# Altium project MPPT_V1.0.1.PrjPcb
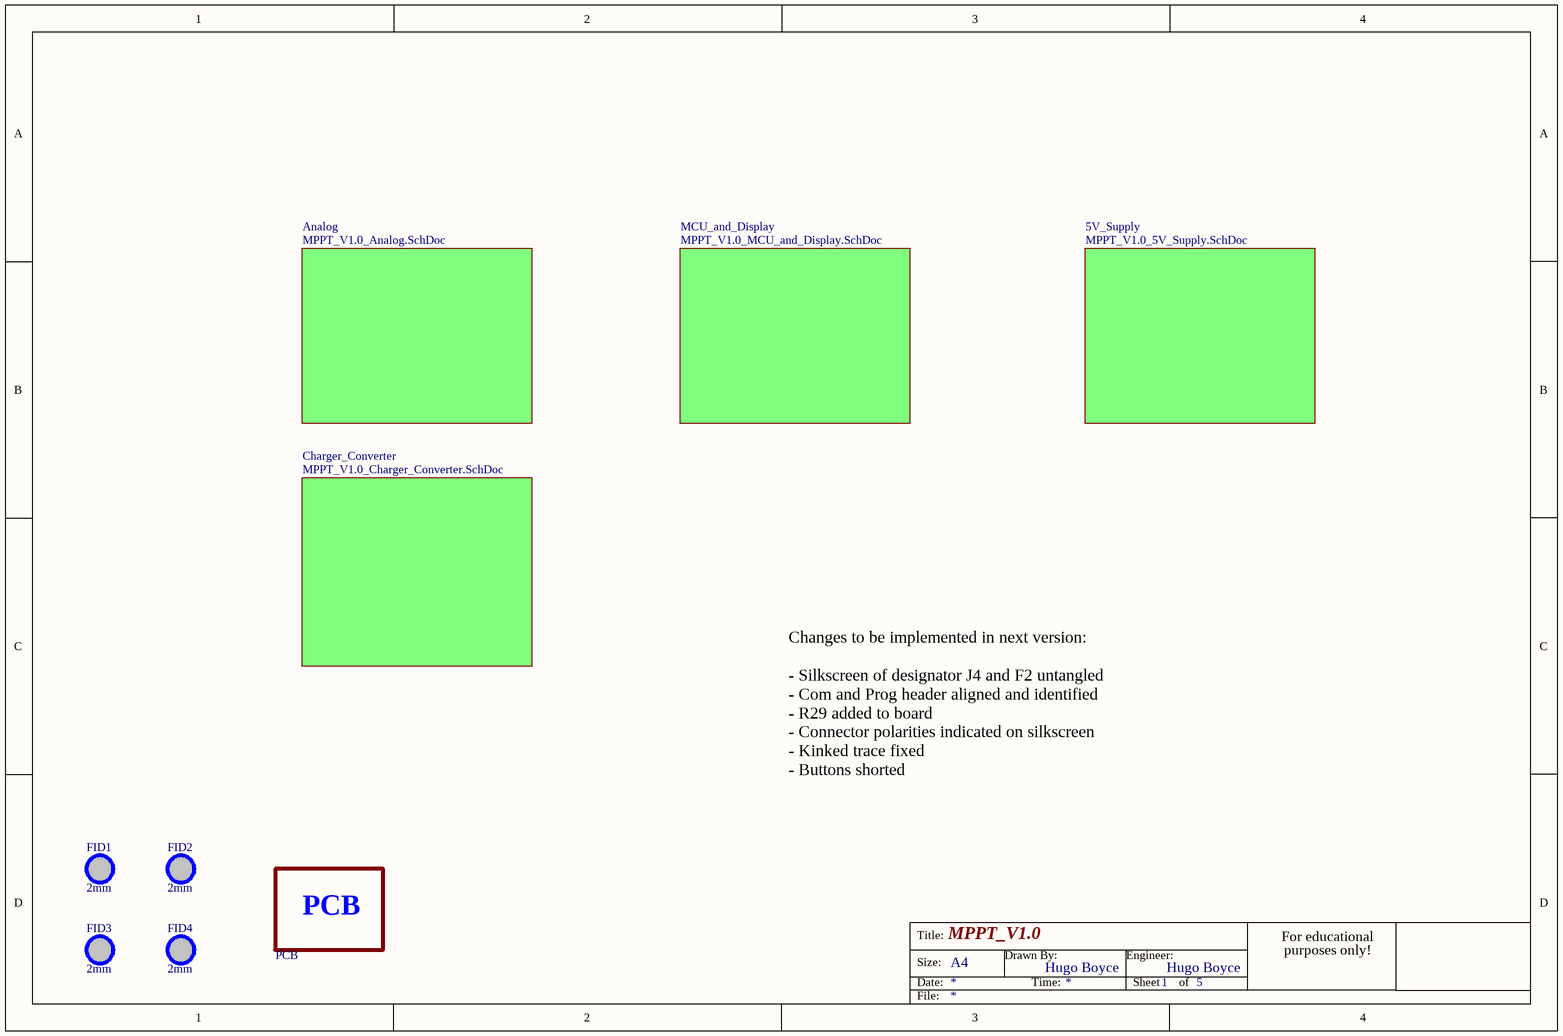
[diagram p0: MPPT_V1.0.1_Main.SchDoc]
Dessinateur: Hugo Boyce; ProjectDrawnBy: Hugo Boyce; Title: MPPT V1.0.1
5 sheets, 92 parts. Net scope: global (net labels, ports and power ports of the same name join across sheets).
Board file: MPPT_V1.0.1.PcbDoc
Sheets:
  MPPT_V1.0.1_Main.SchDoc
  MPPT_V1.0.1_MCU_and_Display.SchDoc
  MPPT_V1.0.1_Analog.SchDoc
  MPPT_V1.0.1_5V_Supply.SchDoc
  MPPT_V1.0.1_Charger_Converter.SchDoc

## Sheet MPPT_V1.0.1_Main.SchDoc: MPPT_V1.0
size A4; DrawnBy: Hugo Boyce; Engineer: Hugo Boyce; Organization: Altium Limited; Address1: L3, 12a Rodborough Rd; Address2: Frenchs Forest; Address3: NSW; Address4: Australia 2086; SheetNumber: 1; SheetTotal: 5

### Parts
FID1  2mm  [FID_2MM]  (no BOM)
FID2  2mm  [FID_2MM]  (no BOM)
FID3  2mm  [FID_2MM]  (no BOM)
FID4  2mm  [FID_2MM]  (no BOM)
PCB  PCB  (value not drawn)

### Sub-sheets
5V_Supply = MPPT_V1.0_5V_Supply.SchDoc (file not in this document): no entries
Analog = MPPT_V1.0_Analog.SchDoc (file not in this document): no entries
Charger_Converter = MPPT_V1.0_Charger_Converter.SchDoc (file not in this document): no entries
MCU_and_Display = MPPT_V1.0_MCU_and_Display.SchDoc (file not in this document): no entries

### Notes on the sheet
- Changes to be implemented in next version:
  - Silkscreen of designator J4 and F2 untangled
  - Com and Prog header aligned and identified
  - R29 added to board
  - Connector polarities indicated on silkscreen
  - Kinked trace fixed
  - Buttons shorted
- Title:
- Size:
- Date:
- A4
- Drawn By:
- Time:
- Engineer:
- Sheet
- of
- For educational
- purposes only!
- File:

### Library data of the parts
FID1-FID4 = FID_2mm: Fiducial, 2mm
PCB = PCB: Printed Circuit Board

## Sheet MPPT_V1.0.1_MCU_and_Display.SchDoc: MPPT_V1.0
size A4; DrawnBy: Hugo Boyce; Engineer: Hugo Boyce; Organization: Altium Limited; Address1: L3, 12a Rodborough Rd; Address2: Frenchs Forest; Address3: NSW; Address4: Australia 2086; SheetNumber: 2; SheetTotal: 5
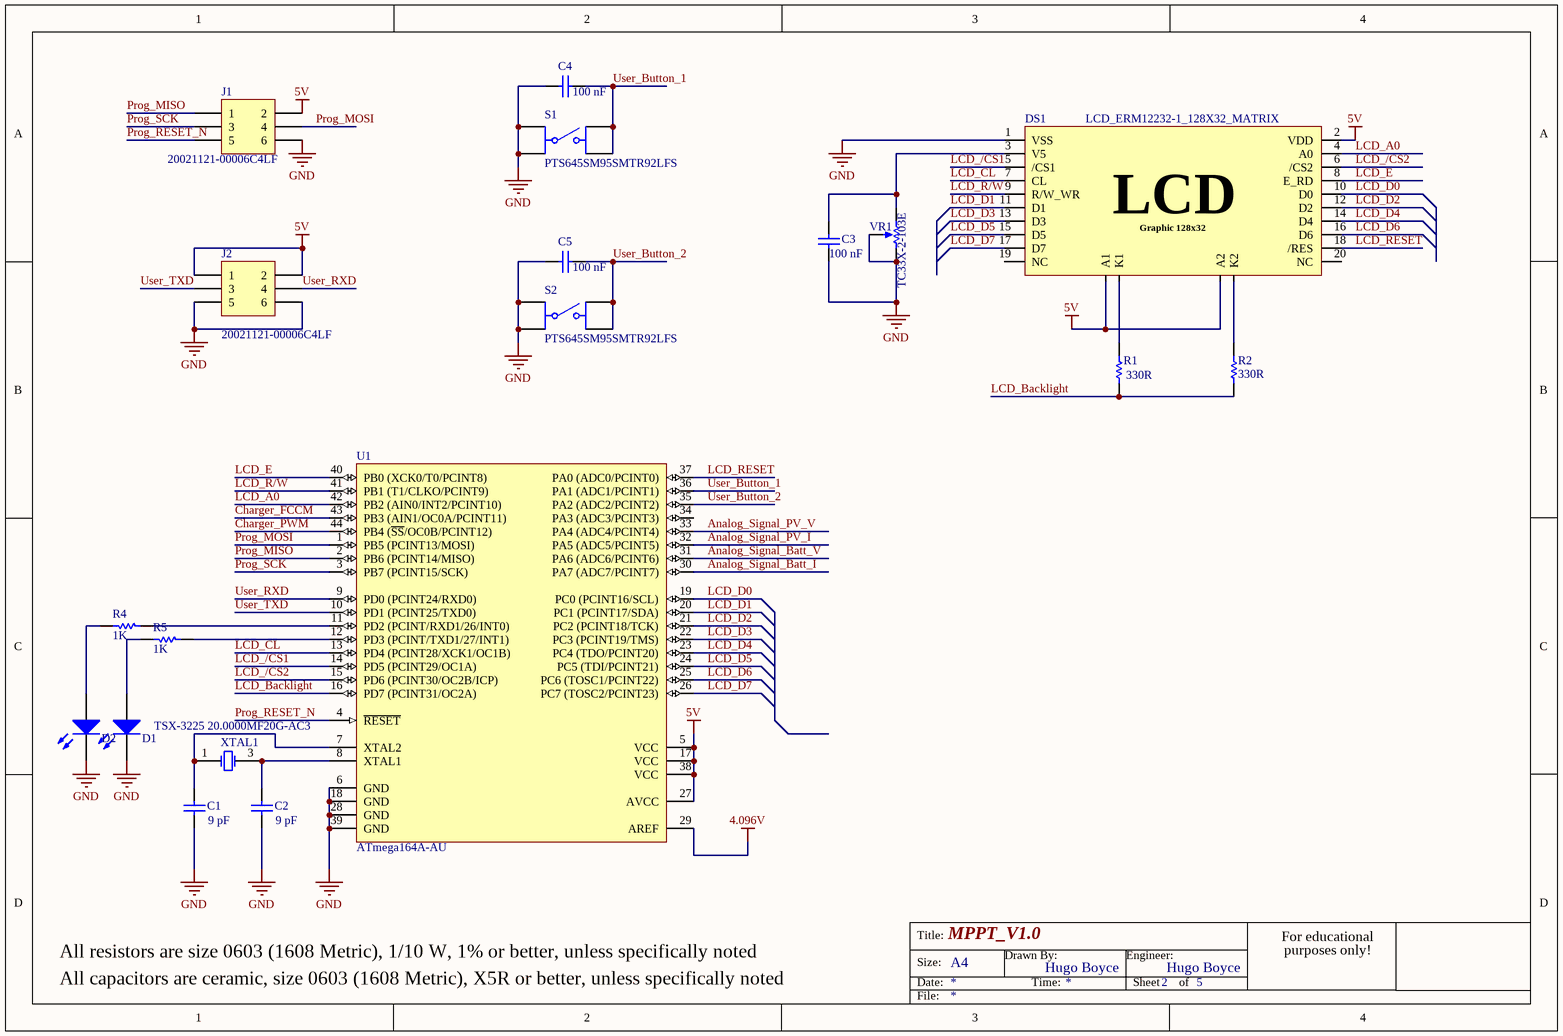
[diagram p1: MPPT_V1.0.1_MCU_and_Display.SchDoc]

### Parts
C1  value 9 pF  [CAPC1608N]  (hidden comment: Cap SMD)
C2  value 9 pF  [CAPC1608N]  (hidden comment: Cap SMD)
C3  value 100 nF  [CAPC1608N]  (hidden comment: Cap SMD)
C4  value 100 nF  [CAPC1608N]  (hidden comment: Cap SMD)
C5  value 100 nF  [CAPC1608N]  (hidden comment: Cap SMD)
D1  150120RS75000  [150120RS75000]  (value not drawn)
D2  150120RS75000  [150120RS75000]  (value not drawn)
DS1  LCD_ERM12232-1_128X32_MATRIX  [LCD_ERM12232]
J1  20021121-00006C4LF  [20021121-00006]
J2  20021121-00006C4LF  [20021121-00006]
R1  value 330R  [RESC1608N]  (hidden comment: Res SMD)
R2  value 330R  [RESC1608N]  (hidden comment: Res SMD)
R4  value 1K  [RESC1608N]  (hidden comment: Res SMD)
R5  value 1K  [RESC1608N]  (hidden comment: Res SMD)
S1  PTS645SM95SMTR92LFS  [PTS645SM95SMTR92LFS]
S2  PTS645SM95SMTR92LFS  [PTS645SM95SMTR92LFS]
U1  ATmega164A-AU  [44A_N]
VR1  TC33X-2-103E  [TC33_BOURNS]
XTAL1  TSX-3225 20.0000MF20G-AC3  [EPSON_TSX-3225]

### Nets
4.096V: U1.29(AREF)
5V: DS1.2(VDD) DS1.21(A1) DS1.23(A2) J1.2 J2.1 J2.2 U1.5(VCC) U1.17(VCC) U1.27(AVCC) U1.38(VCC)
GND: C1.1 C2.1 C3.1 C4.2 C5.2 D1.1(K) D2.1(K) DS1.1(VSS) J1.6 J2.5 J2.6 S1.1 S1.3 S2.1 S2.3 U1.6(GND) U1.18(GND) U1.28(GND) U1.39(GND) VR1.1(CCW) VR1.2(WIPER)
Analog_Signal_Batt_I: U1.30(PA7_(ADC7/PCINT7))
Analog_Signal_Batt_V: U1.31(PA6_(ADC6/PCINT6))
Analog_Signal_PV_I: U1.32(PA5_(ADC5/PCINT5))
Analog_Signal_PV_V: U1.33(PA4_(ADC4/PCINT4))
Charger_FCCM: U1.43(PB3_(AIN1/OC0A/PCINT11))
Charger_PWM: U1.44(PB4_(~{SS}/OC0B/PCINT12))
LCD_/CS1: DS1.5(/CS1) U1.14(PD5_(PCINT29/OC1A))
LCD_/CS2: DS1.6(/CS2) U1.15(PD6_(PCINT30/OC2B/ICP))
LCD_A0: DS1.4(A0) U1.42(PB2_(AIN0/INT2/PCINT10))
LCD_Backlight: R1.1 R2.1 U1.16(PD7_(PCINT31/OC2A))
LCD_CL: DS1.7(CL) U1.13(PD4_(PCINT28/XCK1/OC1B))
LCD_D0: DS1.10(D0) U1.19(PC0_(PCINT16/SCL))
LCD_D1: DS1.11(D1) U1.20(PC1_(PCINT17/SDA))
LCD_D2: DS1.12(D2) U1.21(PC2_(PCINT18/TCK))
LCD_D3: DS1.13(D3) U1.22(PC3_(PCINT19/TMS))
LCD_D4: DS1.14(D4) U1.23(PC4_(TDO/PCINT20))
LCD_D5: DS1.15(D5) U1.24(PC5_(TDI/PCINT21))
LCD_D6: DS1.16(D6) U1.25(PC6_(TOSC1/PCINT22))
LCD_D7: DS1.17(D7) U1.26(PC7_(TOSC2/PCINT23))
LCD_E: DS1.8(E_RD) U1.40(PB0_(XCK0/T0/PCINT8))
LCD_R/W: DS1.9(R/W_WR) U1.41(PB1_(T1/CLKO/PCINT9))
LCD_RESET: DS1.18(/RES) U1.37(PA0_(ADC0/PCINT0))
Prog_MISO: J1.1 U1.2(PB6_(PCINT14/MISO))
Prog_MOSI: J1.4 U1.1(PB5_(PCINT13/MOSI))
Prog_RESET_N: J1.5 U1.4(~{RESET})
Prog_SCK: J1.3 U1.3(PB7_(PCINT15/SCK))
User_Button_1: C4.1 S1.2 S1.4 U1.36(PA1_(ADC1/PCINT1))
User_Button_2: C5.1 S2.2 S2.4 U1.35(PA2_(ADC2/PCINT2))
User_RXD: J2.4 U1.9(PD0_(PCINT24/RXD0))
User_TXD: J2.3 U1.10(PD1_(PCINT25/TXD0))
NetC1_2: C1.2 U1.7(XTAL2) XTAL1.1(OSC1)
NetC2_2: C2.2 U1.8(XTAL1) XTAL1.3(OSC2)
NetC3_2: C3.2 DS1.3(V5) VR1.3(CW)
NetD1_2: D1.2(A) R5.2
NetD2_2: D2.2(A) R4.2
NetDS1_22: DS1.22(K1) R1.2
NetDS1_24: DS1.24(K2) R2.2
NetR4_1: R4.1 U1.11(PD2_(PCINT/RXD1/26/INT0))
NetR5_1: R5.1 U1.12(PD3_(PCINT/TXD1/27/INT1))

Not connected (* = marked no-connect by the designer): DS1 19(NC) 20(NC); U1 34(PA3_(ADC3/PCINT3))

### Notes on the sheet
- All resistors are size 0603 (1608 Metric), 1/10 W, 1% or better, unless specifically noted
- All capacitors are ceramic, size 0603 (1608 Metric), X5R or better, unless specifically noted
- Title:
- Size:
- Date:
- A4
- Drawn By:
- Time:
- Engineer:
- Sheet
- of
- For educational
- purposes only!
- File:
- (in symbol LCD_ERM12232-1_128X64_MATRIX) LCD; Graphic 128x32

### Library data of the parts
C1-C5 = Cap SMD: Capacitor; Published: 8-Jun-2000; LatestRevisionDate: 17-Jul-2002; LatestRevisionNote: Re-released for DXP Platform.; PackageReference: RAD-0.3; Publisher: Altium Limited; PackageDescription: Radial Cap, Thru-Hole; 2 Leads; 0.3 in Pin Spacing
D1 D2 = 150120RS75000: LED RED CLEAR 1206 SMD; Manufacturer: Wurth Electronics Inc.; Lens Color: Colorless; Millicandela Rating: 150mcd; Lens Style/Size: Rectangle with Flat Top, 2.00mm x 1.60mm; Voltage - Forward (Vf) (Typ): 2V; Current - Test: 20mA; Viewing Angle: 140°; Wavelength - Dominant: 625nm; Wavelength - Peak: 630nm; Supplier 1: Digi-Key; RoHS: RoHS Compliant; Category: Optoelectronics; Stock 1: 14076; Pricing 1: 1=0.27, 50=0.2582, 100=0.2211, 500=0.18952 (CAD); Packaging: Cut Tape (CT); Part Status: Active; Color: Red; Lens Transparency: Clear; Mounting Type: Surface Mount; Features: -; Package / Case: 1206 (3216 Metric); Supplier Device Package: 1206; Size / Dimension: 3.20mm L x 1.60mm W; Height (Max): 0.69mm; ComponentLink1URL: http://katalog.we-online.de/led/datasheet/150120RS75000.pdf; ComponentLink1Description: http://katalog.we-online.de/led/datasheet/150120RS75000.pdf; Supplier Part Number 1: 732-4991-1-ND; Manufacturer Part Number: 150120RS75000
DS1 = LCD_ERM12232-1_128X64_MATRIX: 128x64 Graphic LCD Module, EastRising
J1 J2 = 20021121-00006C4LF: CONN HEADER 6POS DL UNSHRD SMD; Manufacturer: Amphenol FCI; Pitch - Mating: 0.050" (1.27mm); Number of Positions: 6; Number of Positions Loaded: All; Style: Board to Board; Shrouding: Unshrouded; Contact Length - Mating: 0.120" (3.05mm); Material Flammability Rating: UL94 V-0; Supplier 1: Digi-Key; RoHS: RoHS Compliant; Category: Connectors, Interconnects; Stock 1: 40686; Pricing 1: 1=0.73, 10=0.683, 100=0.523 (CAD); Packaging: Cut Tape (CT); Part Status: Active; Connector Type: Header; Contact Type: Male Pin; Number of Rows: 2; Row Spacing - Mating: 0.050" (1.27mm); Mounting Type: Surface Mount; Termination: Solder; Fastening Type: Push-Pull; Contact Length - Post: -; Overall Contact Length: -; Insulation Height: -; Contact Shape: Square; Contact Finish - Mating: Gold; Contact Finish Thickness - Mating: 10µin (0.25µm); Contact Finish - Post: Tin; Contact Material: Copper Alloy; Insulation Material: Thermoplastic; Features: Pick and Place; Operating Temperature: -; Ingress Protection: -; Insulation Color: Black; Current Rating: -; Voltage Rating: -; Mated Stacking Heights: -; Contact Finish Thickness - Post: 50µin (1.27µm); Applications: -; ComponentLink1URL: https://cdn.amphenol-icc.com/media/wysiwyg/files/drawing/20021121.pdf; ComponentLink1Description: https://cdn.amphenol-icc.com/media/wysiwyg/files/drawing/20021121.pdf; Supplier Part Number 1: 609-3693-1-ND; Manufacturer Part Number: 20021121-00006C4LF
R1 R2 R4 R5 = Res SMD: Resistor; Published: 8-Jun-2000; LatestRevisionDate: 17-Jul-2002; LatestRevisionNote: Re-released for DXP Platform.; PackageReference: AXIAL-0.3; Publisher: Altium Limited; PackageDescription: Axial Device, Thru-Hole; 2 Leads; 0.3 in Pin Spacing
S1 S2 = PTS645SM95SMTR92LFS: SWITCH TACTILE SPST-NO 0.05A 12V; Manufacturer: C&K; Switch Function: Off-Mom; Contact Rating @ Voltage: 0.05A @ 12VDC; Actuator Type: Standard; Actuator Height off PCB, Vertical: 9.50mm; Actuator Orientation: Top Actuated; Outline: 6.00mm x 6.00mm; Illumination: Non-Illuminated; Operating Force: 160gf; Actuator Material: Polyamide (PA66), Nylon 6/6; Mechanical Life: 100,000 Cycles; Supplier 1: Digi-Key; RoHS: RoHS Compliant; Category: Switches; Stock 1: 8178; Pricing 1: 1=0.41, 10=0.404, 25=0.3896, 50=0.3752, 100=0.3545, 250=0.3336 (CAD); Packaging: Cut Tape (CT); Part Status: Active; Circuit: SPST-NO; Mounting Type: Surface Mount; Actuator Length, Right Angle: -; Termination Style: Gull Wing; Illumination Type, Color: -; Illumination Voltage (Nominal): -; Ingress Protection: -; Features: Blue Actuator; Switch Travel: -; Operating Temperature: -20°C ~ 60°C; ComponentLink1URL: http://www.ckswitches.com/media/1471/pts645.pdf; ComponentLink1Description: http://www.ckswitches.com/media/1471/pts645.pdf; Supplier Part Number 1: CKN10822CT-ND; Manufacturer Part Number: PTS645SM95SMTR92LFS
U1 = ATmega164A-AU: 8-bit AVR Microcontroller, 16KB Flash, 512 Bytes EEPROM, 1KB SRAM, 44-pin TQFP, Industrial Grade (-40°C to 85°C); Published: 1-Apr-2010; DatasheetVersion: revA, Jan-2010; PackageVersion: rev.B, Oct-2001; PackageReference: 44A; Publisher: Altium Limited; PackageDescription: 44-Pin Plastic Thin Profile Quad Flat Pack, 10 x 10 x 1.0 mm Body, 0.8 mm Pitch (TQFP); Supplier 1: Digi-Key; Supplier Part Number 1: ATMEGA164A-AU-ND; Supplier 2: Mouser; Supplier Part Number 2: 556-ATMEGA164A-AU; ComponentLink1Description: Manufacturer Link; ComponentLink1URL: http://www.atmel.com/products/avr/default.asp?; ComponentLink2Description: ATmega164A/164PA/324A/324PA/644A/644PA/1284/1284P Datasheet; ComponentLink2URL: http://www.atmel.com/dyn/resources/prod_documents/doc8272.pdf; ComponentLink3Description: ATmega164A/164PA/324A/324PA/644A/644PA/1284/1284P Summary; ComponentLink3URL: http://www.atmel.com/dyn/resources/prod_documents/8272S.pdf; ComponentLink4Description: Atmel.com Home; ComponentLink4URL: http://www.atmel.com
VR1 = TC33X-2-103E: TRIMMER 10K OHM 0.1W SMD; Manufacturer: Bourns Inc.; Power (Watts): 0.1W, 1/10W; Tolerance: ±25%; Temperature Coefficient: ±250ppm/°C; Adjustment Type: Top Adjustment; Resistive Material: Cermet; Supplier 1: Digi-Key; RoHS: RoHS Compliant; Category: Potentiometers, Variable Resistors; Stock 1: 75902; Pricing 1: 1=0.41, 10=0.405, 25=0.366, 50=0.3492, 100=0.3378, 250=0.31532, 500=0.28716, 1000=0.259 (CAD); Packaging: Cut Tape (CT); Part Status: Active; Mounting Type: Surface Mount; Termination Style: J Lead; Size / Dimension: Rectangular - 0.150" x 0.142" Face x 0.047" H (3.80mm x 3.60mm x 1.20mm); ComponentLink1URL: http://www.bourns.com/docs/Product-Datasheets/TC33.pdf; ComponentLink1Description: http://www.bourns.com/docs/Product-Datasheets/TC33.pdf; Supplier Part Number 1: TC33X-103ECT-ND; Manufacturer Part Number: TC33X-2-103E
XTAL1 = TSX-3225 20.0000MF20G-AC3: CRYSTAL 20.0000MHZ 9PF SMD; Manufacturer: EPSON; Frequency Stability: ±20ppm; Frequency Tolerance: ±10ppm; Operating Mode: Fundamental; Supplier 1: Digi-Key; RoHS: RoHS Compliant; Category: Crystals, Oscillators, Resonators; Stock 1: 5308; Pricing 1: 1=0.77, 10=0.643, 50=0.578, 100=0.5136 (CAD); Packaging: Cut Tape (CT); Part Status: Active; Type: MHz Crystal; Load Capacitance: 9pF; Operating Temperature: -40°C ~ 105°C; Ratings: -; Mounting Type: Surface Mount; Package / Case: 4-SMD, No Lead; Size / Dimension: 0.126" L x 0.098" W (3.20mm x 2.50mm); Height - Seated (Max): 0.024" (0.60mm); ComponentLink1URL: https://support.epson.biz/td/api/doc_check.php?dl=brief_FA-238V_en.pdf; ComponentLink1Description: https://support.epson.biz/td/api/doc_check.php?dl=brief_FA-238V_en.pdf; Supplier Part Number 1: SER3629CT-ND; Manufacturer Part Number: TSX-3225 20.0000MF20G-AC3

## Sheet MPPT_V1.0.1_Analog.SchDoc: MPPT_V1.0
size A4; DrawnBy: Hugo Boyce; Engineer: Hugo Boyce; Organization: Altium Limited; Address1: L3, 12a Rodborough Rd; Address2: Frenchs Forest; Address3: NSW; Address4: Australia 2086; SheetNumber: 3; SheetTotal: 5
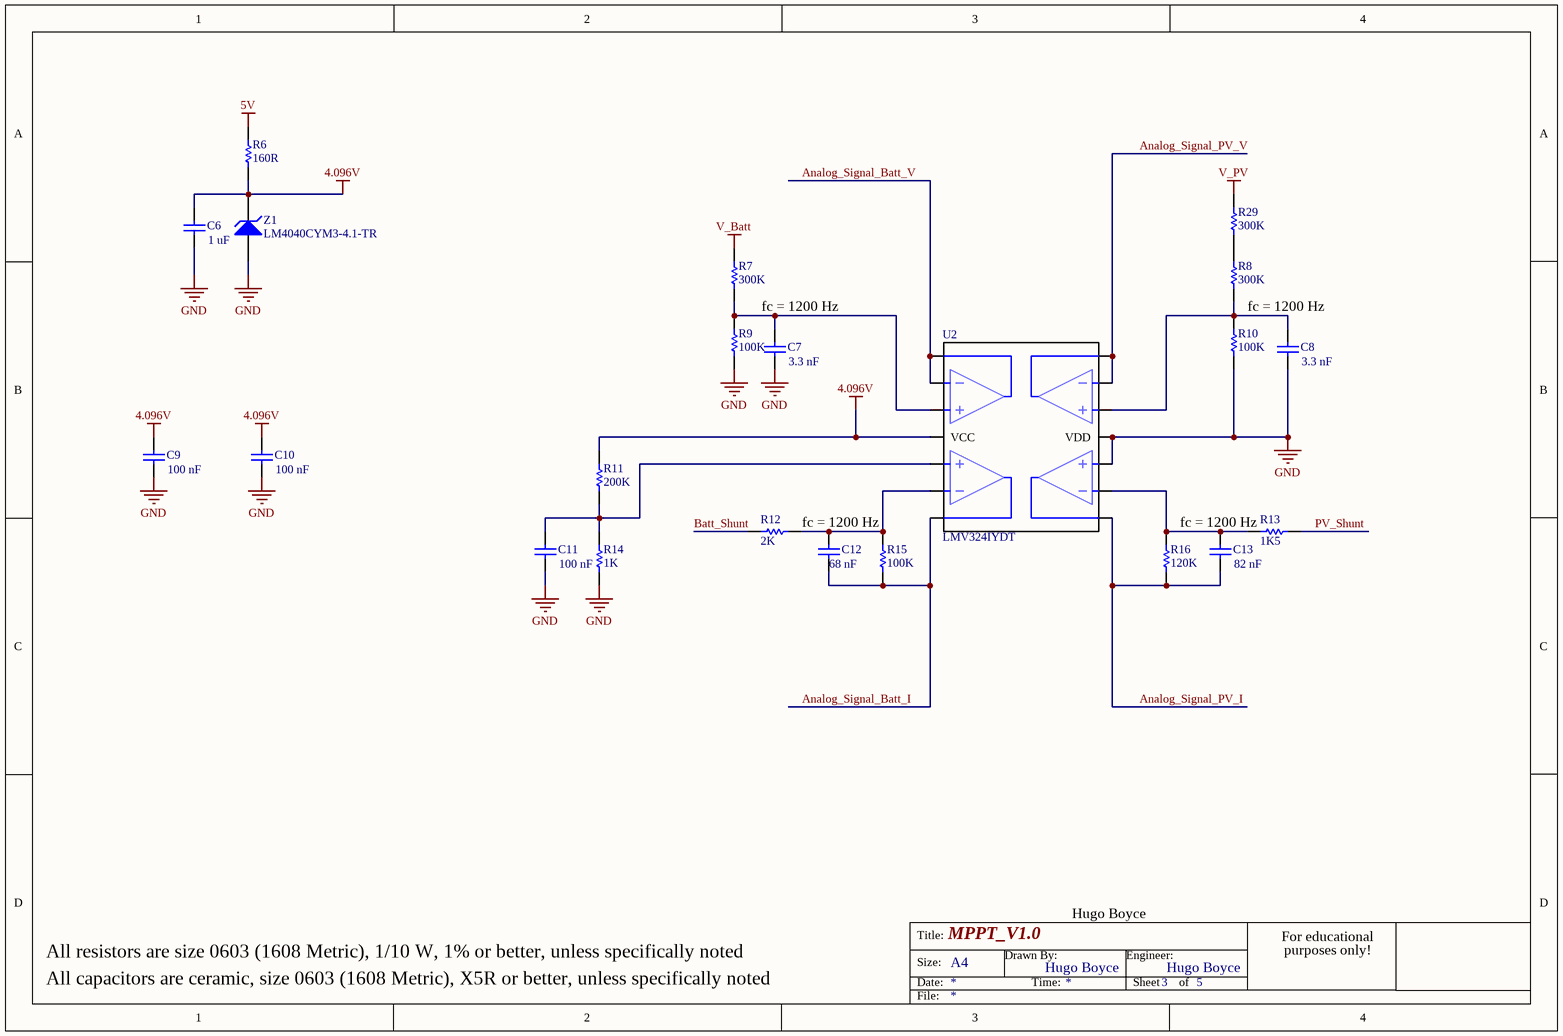
[diagram p2: MPPT_V1.0.1_Analog.SchDoc]

### Parts
C6  value 1 uF  [CAPC1608N]  (hidden comment: Cap SMD)
C7  value 3.3 nF  [CAPC1608N]  (hidden comment: Cap SMD)
C8  value 3.3 nF  [CAPC1608N]  (hidden comment: Cap SMD)
C9  value 100 nF  [CAPC1608N]  (hidden comment: Cap SMD)
C10  value 100 nF  [CAPC1608N]  (hidden comment: Cap SMD)
C11  value 100 nF  [CAPC1608N]  (hidden comment: Cap SMD)
C12  value 68 nF  [CAPC1608N]  (hidden comment: Cap SMD)
C13  value 82 nF  [CAPC1608N]  (hidden comment: Cap SMD)
R6  value 160R  [RESC1608N]  (hidden comment: Res SMD)
R7  value 300K  [RESC1608N]  (hidden comment: Res SMD)
R8  value 300K  [RESC1608N]  (hidden comment: Res SMD)
R9  value 100K  [RESC1608N]  (hidden comment: Res SMD)
R10  value 100K  [RESC1608N]  (hidden comment: Res SMD)
R11  value 200K  [RESC1608N]  (hidden comment: Res SMD)
R12  value 2K  [RESC1608N]  (hidden comment: Res SMD)
R13  value 1K5  [RESC1608N]  (hidden comment: Res SMD)
R14  value 1K  [RESC1608N]  (hidden comment: Res SMD)
R15  value 100K  [RESC1608N]  (hidden comment: Res SMD)
R16  value 120K  [RESC1608N]  (hidden comment: Res SMD)
R29  value 300K  [RESC1608N]  (hidden comment: Res SMD)
U2  LMV324IYDT  [LMV324IYDT]
Z1  LM4040CYM3-4.1-TR  [LM4040C]

### Nets
4.096V: C6.2 C9.2 C10.2 R6.1 R11.2 U2.4(VCC) Z1.1(K)
5V: R6.2
GND: C6.1 C7.1 C8.1 C9.1 C10.1 C11.1 R9.1 R10.1 R14.1 U2.10(IN+_3) U2.11(VDD) Z1.2(A)
V_Batt: R7.2
V_PV: R29.2
Analog_Signal_Batt_I: C12.1 R15.1 U2.7(OUT_2)
Analog_Signal_Batt_V: U2.1(OUT1) U2.2(IN-_1)
Analog_Signal_PV_I: C13.1 R16.1 U2.8(OUT_3)
Analog_Signal_PV_V: U2.13(IN-_4) U2.14(OUT_4)
Batt_Shunt: R12.1
PV_Shunt: R13.2
NetC7_2: C7.2 R7.1 R9.2 U2.3(IN+_1)
NetC8_2: C8.2 R8.1 R10.2 U2.12(IN+_4)
NetC11_2: C11.2 R11.1 R14.2 U2.5(IN-_2)
NetC12_2: C12.2 R12.2 R15.2 U2.6(IN+_2)
NetC13_2: C13.2 R13.1 R16.2 U2.9(IN-_3)
NetR8_2: R8.2 R29.1

### Notes on the sheet
- fc = 1200 Hz
- (near R13) fc = 1200 Hz
- All resistors are size 0603 (1608 Metric), 1/10 W, 1% or better, unless specifically noted
- All capacitors are ceramic, size 0603 (1608 Metric), X5R or better, unless specifically noted
- Title:
- Size:
- Date:
- A4
- Drawn By:
- Time:
- Engineer:
- Sheet
- of
- For educational
- purposes only!
- File:

### Library data of the parts
C6-C13 = Cap SMD: Capacitor; Published: 8-Jun-2000; LatestRevisionDate: 17-Jul-2002; LatestRevisionNote: Re-released for DXP Platform.; PackageReference: RAD-0.3; Publisher: Altium Limited; PackageDescription: Radial Cap, Thru-Hole; 2 Leads; 0.3 in Pin Spacing
R6-R16 R29 = Res SMD: Resistor; Published: 8-Jun-2000; LatestRevisionDate: 17-Jul-2002; LatestRevisionNote: Re-released for DXP Platform.; PackageReference: AXIAL-0.3; Publisher: Altium Limited; PackageDescription: Axial Device, Thru-Hole; 2 Leads; 0.3 in Pin Spacing
U2 = LMV324IYDT: IC OPAMP GP 1.3MHZ RRO 14SO; Manufacturer: STMicroelectronics; Amplifier Type: General Purpose; Output Type: Rail-to-Rail; Slew Rate: 0.45 V/µs; Current - Supply: 162µA; Voltage - Supply, Single/Dual (±): 2.7 V ~ 6 V; Supplier 1: Digi-Key; RoHS: RoHS Compliant; Category: Integrated Circuits (ICs); Stock 1: 4245; Pricing 1: 1=0.91, 10=0.779, 100=0.5821, 500=0.4573, 1000=0.35339 (CAD); Packaging: Cut Tape (CT); Part Status: Active; Operating Temperature: -40°C ~ 125°C; Mounting Type: Surface Mount; Package / Case: 14-SOIC (0.154", 3.90mm Width); Supplier Device Package: 14-SO; Base Part Number: LMV324; ComponentLink1URL: http://www.st.com/content/ccc/resource/technical/document/datasheet/b9/d8/3b/8f/a1/8f/46/01/CD00079372.pdf/files/CD00079372.pdf/jcr:content/translations/en.CD00079372.pdf; ComponentLink1Description: http://www.st.com/content/ccc/resource/technical/document/datasheet/b9/d8/3b/8f/a1/8f/46/01/CD00079372.pdf/files/CD00079372.pdf/jcr:content/translations/en.CD00079372.pdf; Supplier Part Number 1: 497-10222-1-ND; Manufacturer Part Number: LMV324IYDT
Z1 = LM4040CYM3-4.1-TR: IC VREF SHUNT 4.096V SOT23; Manufacturer: Microchip Technology; Output Type: Fixed; Tolerance: ±0.5%; Temperature Coefficient: 100ppm/°C; Noise - 10Hz to 10kHz: 80µVrms; Supplier 1: Digi-Key; RoHS: RoHS Compliant; Category: Integrated Circuits (ICs); Stock 1: 1871; Pricing 1: 1=0.5, 25=0.4032, 100=0.372 (CAD); Packaging: Cut Tape (CT); Part Status: Active; Reference Type: Shunt; Voltage - Output (Min/Fixed): 4.096V; Noise - 0.1Hz to 10Hz: -; Voltage - Input: -; Current - Supply: -; Operating Temperature: -40°C ~ 85°C (TA); Mounting Type: Surface Mount; Package / Case: TO-236-3, SC-59, SOT-23-3; Supplier Device Package: SOT-23-3; Base Part Number: LM4040; ComponentLink1URL: http://www.microchip.com/mymicrochip/filehandler.aspx?ddocname=en579040; ComponentLink1Description: http://www.microchip.com/mymicrochip/filehandler.aspx?ddocname=en579040; Supplier Part Number 1: 576-2568-1-ND; Manufacturer Part Number: LM4040CYM3-4.1-TR

## Sheet MPPT_V1.0.1_5V_Supply.SchDoc: MPPT_V1.0
size A4; DrawnBy: Hugo Boyce; Engineer: Hugo Boyce; Organization: Altium Limited; Address1: L3, 12a Rodborough Rd; Address2: Frenchs Forest; Address3: NSW; Address4: Australia 2086; SheetNumber: 4; SheetTotal: 5
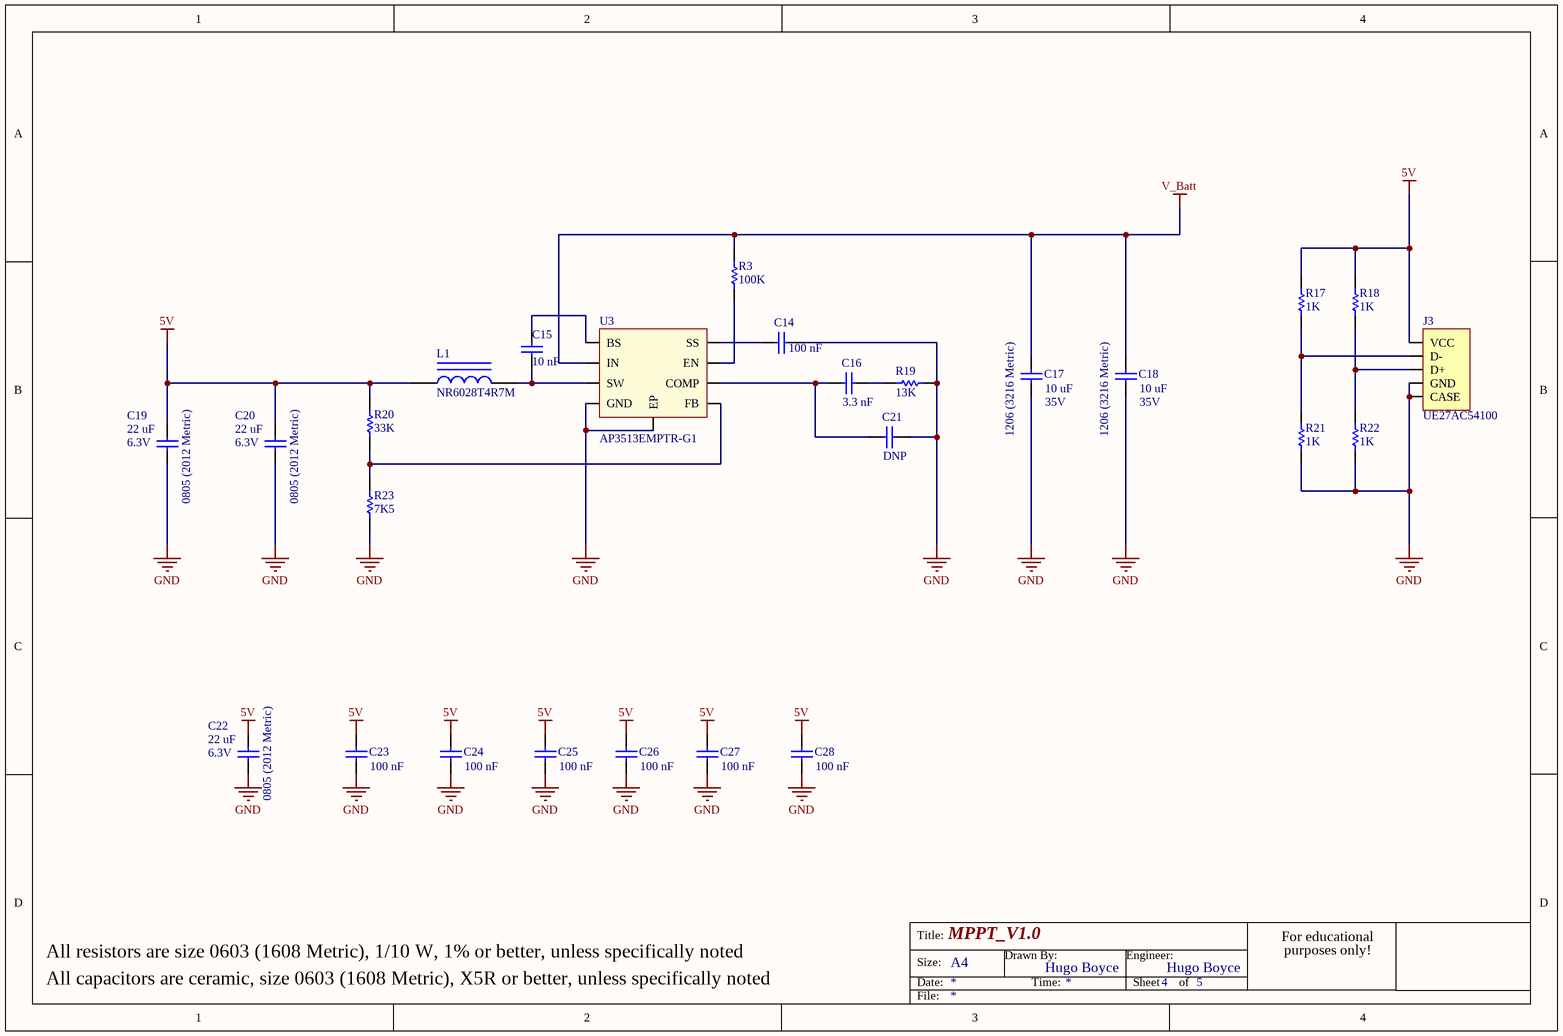
[diagram p3: MPPT_V1.0.1_5V_Supply.SchDoc]

### Parts
C14  value 100 nF  [CAPC1608N]  (hidden comment: Cap SMD)
C15  value 10 nF  [CAPC1608N]  (hidden comment: 1608)
C16  value 3.3 nF  [CAPC1608N]  (hidden comment: Cap SMD)
C17  value 10 uF  Size: 1206 (3216 Metric)  Voltage Rating: 35V  [CAPC3216N]  (hidden comment: Cap SMD)
C18  value 10 uF  Size: 1206 (3216 Metric)  Voltage Rating: 35V  [CAPC3216N]  (hidden comment: Cap SMD)
C19  value 22 uF  Size: 0805 (2012 Metric)  Voltage Rating: 6.3V  [CAPC2012N]  (hidden comment: JMK212BBJ226MGHT)
C20  value 22 uF  Size: 0805 (2012 Metric)  Voltage Rating: 6.3V  [CAPC2012N]  (hidden comment: JMK212BBJ226MGHT)
C21  value DNP  [CAPC1608N]  (hidden comment: Cap SMD)
C22  value 22 uF  Size: 0805 (2012 Metric)  Voltage Rating: 6.3V  [CAPC2012N]  (hidden comment: JMK212BBJ226MGHT)
C23  value 100 nF  [CAPC1608N]  (hidden comment: Cap SMD)
C24  value 100 nF  [CAPC1608N]  (hidden comment: Cap SMD)
C25  value 100 nF  [CAPC1608N]  (hidden comment: Cap SMD)
C26  value 100 nF  [CAPC1608N]  (hidden comment: Cap SMD)
C27  value 100 nF  [CAPC1608N]  (hidden comment: Cap SMD)
C28  value 100 nF  [CAPC1608N]  (hidden comment: Cap SMD)
J3  UE27AC54100  [UE27AC5410]
L1  NR6028T4R7M  [NR6028]
R3  value 100K  [RESC1608N]  (hidden comment: Res SMD)
R17  value 1K  [RESC1608N]  (hidden comment: Res SMD)
R18  value 1K  [RESC1608N]  (hidden comment: Res SMD)
R19  value 13K  [RESC1608N]  (hidden comment: Res SMD)
R20  value 33K  [RESC1608N]  (hidden comment: Res SMD)
R21  value 1K  [RESC1608N]  (hidden comment: Res SMD)
R22  value 1K  [RESC1608N]  (hidden comment: Res SMD)
R23  value 7K5  [RESC1608N]  (hidden comment: Res SMD)
U3  AP3513EMPTR-G1  [AP3513E]

### Nets
5V: C19.2 C20.2 C22.2 C23.2 C24.2 C25.2 C26.2 C27.2 C28.2 J3.1(VCC) L1.1 R17.2 R18.2 R20.2
GND: C14.2 C17.1 C18.1 C19.1 C20.1 C21.2 C22.1 C23.1 C24.1 C25.1 C26.1 C27.1 C28.1 J3.4(GND) J3.5(CASE) R19.2 R21.1 R22.1 R23.1 U3.4(GND) U3.9(EP)
V_Batt: C17.2 C18.2 R3.2 U3.2(IN)
NetC14_1: C14.1 U3.8(SS)
NetC15_1: C15.1 L1.2 U3.3(SW)
NetC15_2: C15.2 U3.1(BS)
NetC16_1: C16.1 C21.1 U3.6(COMP)
NetC16_2: C16.2 R19.1
NetJ3_2: J3.2(D-) R17.1 R21.2
NetJ3_3: J3.3(D+) R18.1 R22.2
NetR3_1: R3.1 U3.7(EN)
NetR20_1: R20.1 R23.2 U3.5(FB)

### Notes on the sheet
- All resistors are size 0603 (1608 Metric), 1/10 W, 1% or better, unless specifically noted
- All capacitors are ceramic, size 0603 (1608 Metric), X5R or better, unless specifically noted
- Title:
- Size:
- Date:
- A4
- Drawn By:
- Time:
- Engineer:
- Sheet
- of
- For educational
- purposes only!
- File:

### Library data of the parts
C14-C28 = Cap SMD: Capacitor; Published: 8-Jun-2000; LatestRevisionDate: 17-Jul-2002; LatestRevisionNote: Re-released for DXP Platform.; PackageReference: RAD-0.3; Publisher: Altium Limited; PackageDescription: Radial Cap, Thru-Hole; 2 Leads; 0.3 in Pin Spacing
J3 = UE27AC54100: CONN RCPT USB TYPE A R/A GOLD; Manufacturer: Amphenol Commercial Products; Connector Type: USB - A; Number of Contacts: 4; Gender: Receptacle; Specifications: USB 2.0; Current Rating: 1A per Contact; Voltage - Rated: 30VAC; Mating Cycles: 1500; Shielding: Shielded; Material Flammability Rating: UL94 V-0; Supplier 1: Digi-Key; RoHS: RoHS Compliant; Category: Connectors, Interconnects; Stock 1: 45705; Pricing 1: 1=0.55, 10=0.519, 25=0.4676, 50=0.4154, 100=0.398, 250=0.3634, 500=0.34608, 1000=0.28552, 2500=0.25956 (CAD); Packaging: Tray; Part Status: Active; Mounting Type: Through Hole, Right Angle; Mounting Feature: Horizontal; Termination: Solder; Features: Board Lock; Ingress Protection: -; Operating Temperature: -40°C ~ 85°C; Contact Finish: Gold; Shell/Shielding Material: Copper Alloy; Insulation Color: Black; ComponentLink1URL: https://www.amphenolcanada.com/ProductSearch/drawings/AC/UE27ACX4X0X.pdf; ComponentLink1Description: https://www.amphenolcanada.com/ProductSearch/drawings/AC/UE27ACX4X0X.pdf; Supplier Part Number 1: UE27AC54100-ND; Manufacturer Part Number: UE27AC54100
L1 = NR6028T4R7M: FIXED IND 4.7UH 3A 40.3 MOHM SMD; Manufacturer: Taiyo Yuden; Type: Wirewound; Material - Core: Ferrite; Tolerance: ±20%; Shielding: Shielded; DC Resistance (DCR): 40.3 mOhm Max; Supplier 1: Digi-Key; RoHS: RoHS Compliant; Category: Inductors, Coils, Chokes; Stock 1: 64654; Pricing 1: 1=0.53, 10=0.47, 100=0.3235, 500=0.27646, 1000=0.21175 (CAD); Packaging: Cut Tape (CT); Part Status: Active; Q @ Freq: -; Ratings: -; Operating Temperature: -25°C ~ 120°C; Mounting Type: Surface Mount; Package / Case: Nonstandard; Supplier Device Package: -; Size / Dimension: 0.236" L x 0.236" W (6.00mm x 6.00mm); Height - Seated (Max): 0.110" (2.80mm); ComponentLink1URL: https://www.yuden.co.jp/productdata/catalog/wound04_e.pdf; ComponentLink1Description: https://www.yuden.co.jp/productdata/catalog/wound04_e.pdf; Supplier Part Number 1: 587-2100-1-ND; Manufacturer Part Number: NR6028T4R7M
R3 R17-R23 = Res SMD: Resistor; Published: 8-Jun-2000; LatestRevisionDate: 17-Jul-2002; LatestRevisionNote: Re-released for DXP Platform.; PackageReference: AXIAL-0.3; Publisher: Altium Limited; PackageDescription: Axial Device, Thru-Hole; 2 Leads; 0.3 in Pin Spacing
U3 = AP3513EMPTR-G1: IC REG BUCK ADJ 3A SYNC 8SOIC; Manufacturer: Diodes Incorporated; Function: Step-Down; Output Configuration: Positive; Output Type: Adjustable; Number of Outputs: 1; Voltage - Input (Min): 4.5V; Voltage - Input (Max): 18V; Voltage - Output (Min/Fixed): 0.925V; Voltage - Output (Max): 16.2V; Frequency - Switching: 500kHz; Synchronous Rectifier: Yes; Supplier 1: Digi-Key; RoHS: RoHS Compliant; Category: Integrated Circuits (ICs); Stock 1: 23505; Pricing 1: 1=0.92, 10=0.791, 100=0.5905, 500=0.46394, 1000=0.3585 (CAD); Packaging: Cut Tape (CT); Part Status: Active; Topology: Buck; Current - Output: 3A; Operating Temperature: -40°C ~ 85°C (TA); Mounting Type: Surface Mount; Package / Case: 8-SOIC (0.154", 3.90mm Width) Exposed Pad; Supplier Device Package: 8-PSOP; ComponentLink1URL: https://www.diodes.com/assets/Datasheets/AP3513E.pdf; ComponentLink1Description: https://www.diodes.com/assets/Datasheets/AP3513E.pdf; Supplier Part Number 1: AP3513EMPTR-G1DICT-ND; Manufacturer Part Number: AP3513EMPTR-G1

## Sheet MPPT_V1.0.1_Charger_Converter.SchDoc: MPPT_V1.0
size A4; DrawnBy: Hugo Boyce; Engineer: Hugo Boyce; Organization: Altium Limited; Address1: L3, 12a Rodborough Rd; Address2: Frenchs Forest; Address3: NSW; Address4: Australia 2086; SheetNumber: 5; SheetTotal: 5
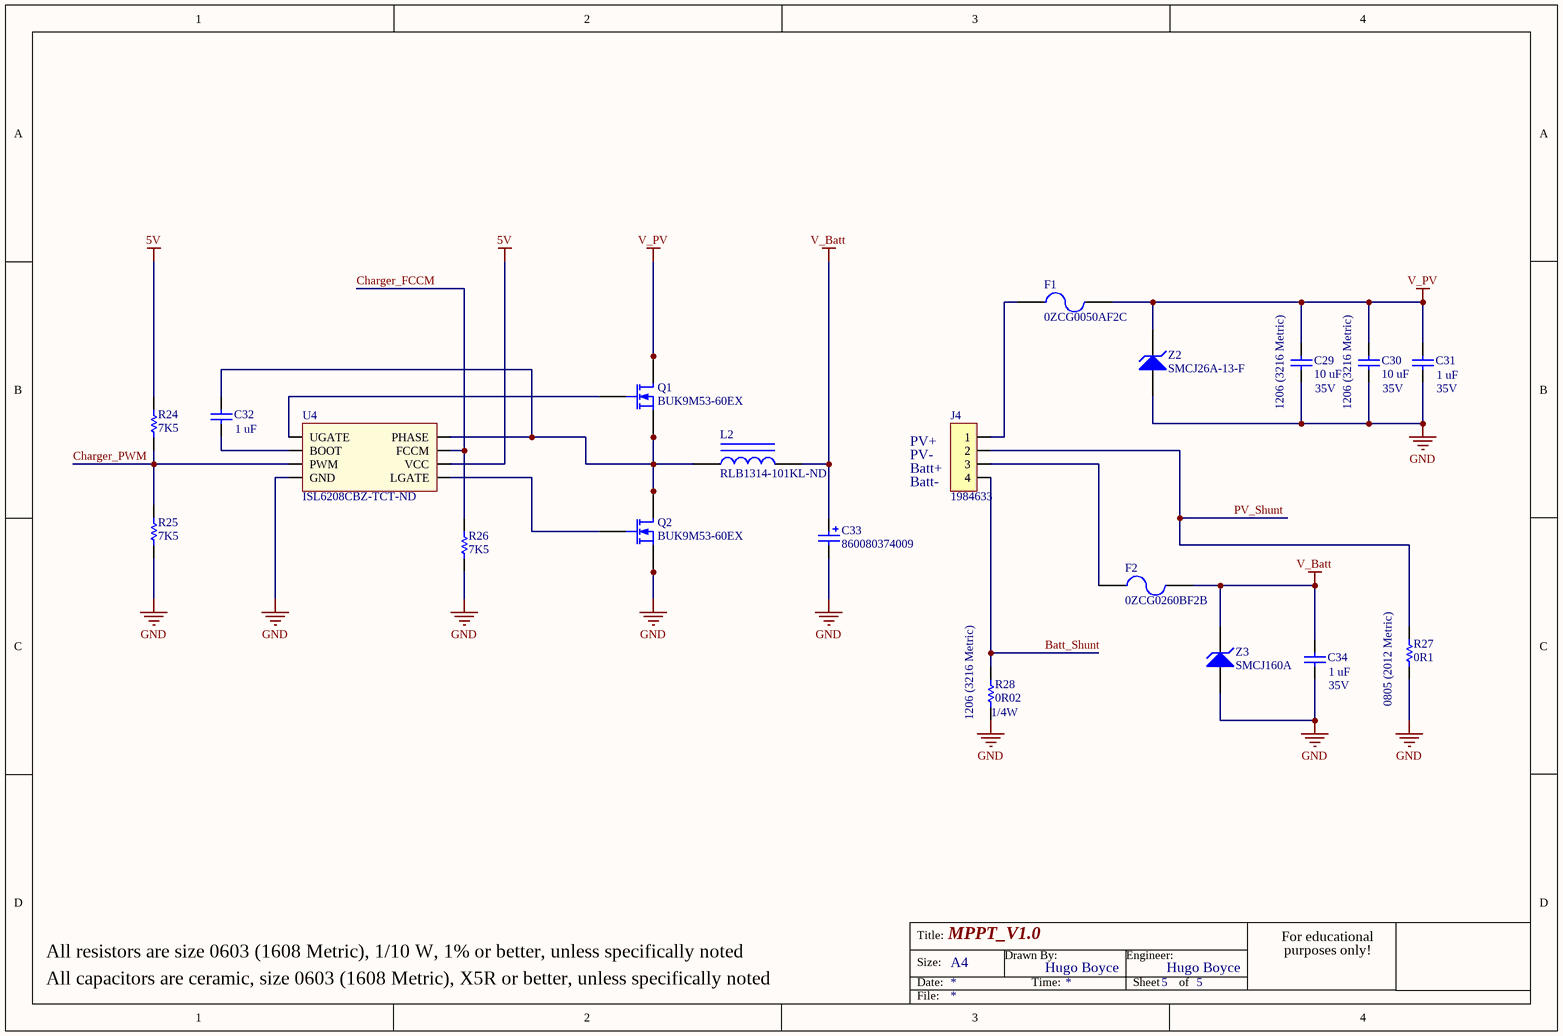
[diagram p4: MPPT_V1.0.1_Charger_Converter.SchDoc]

### Parts
C29  value 10 uF  Size: 1206 (3216 Metric)  Voltage rating: 35V  [CAPC3216N]  (hidden comment: Cap SMD)
C30  value 10 uF  Size: 1206 (3216 Metric)  Voltage rating: 35V  [CAPC3216N]  (hidden comment: Cap SMD)
C31  value 1 uF  Voltage Rating: 35V  [CAPC1608N]  (hidden comment: Cap SMD)
C32  value 1 uF  [CAPC1608N]  (hidden comment: Cap SMD)
C33  860080374009  [860080374009]
C34  value 1 uF  Voltage Rating: 35V  [CAPC1608N]  (hidden comment: Cap SMD)
F1  0ZCG0050AF2C  [OZCG0_BEL_FUSE]
F2  0ZCG0260BF2B  [OZCG0_BEL_FUSE]
J4  1984633  [1984633]
L2  Supplier Part Number 1: RLB1314-101KL-ND  [BOURNS_RLB1314]  (hidden comment: RLB1314-101KL)
Q1  BUK9M53-60EX  [BUK9M53-60E]
Q2  BUK9M53-60EX  [BUK9M53-60E]
R24  value 7K5  [RESC1608N]  (hidden comment: Res SMD)
R25  value 7K5  [RESC1608N]  (hidden comment: Res SMD)
R26  value 7K5  [RESC1608N]  (hidden comment: Res SMD)
R27  value 0R1  Size: 0805 (2012 Metric)  [RESC2012N]  (hidden comment: Res SMD)
R28  value 0R02  Size: 1206 (3216 Metric)  Power Rating: 1/4W  [RESC3216N]  (hidden comment: Res SMD)
U4  Supplier Part Number 1: ISL6208CBZ-TCT-ND  [ISL6208CBZ-T]  (hidden comment: ISL6208CBZ-T)
Z2  SMCJ26A-13-F  [SMCJxxx]
Z3  SMCJ160A  [SMCJxxx]

### Nets
5V: R24.2 U4.6(VCC)
GND: C29.2 C30.2 C31.1 C33.1 C34.1 Q2.1(S) Q2.2(S) Q2.3(S) R25.1 R26.1 R27.2 R28.1 U4.4(GND) Z2.2(A) Z3.2(A)
V_Batt: C33.2 C34.2 F2.2 L2.2 Z3.1(K)
V_PV: C29.1 C30.1 C31.2 F1.2 Q1.5(D) Q1.6(D) Q1.7(D) Q1.8(D) Z2.1(K)
Batt_Shunt: J4.4 R28.2
Charger_FCCM: R26.2 U4.7(FCCM)
Charger_PWM: R24.1 R25.2 U4.3(PWM)
PV_Shunt: J4.2 R27.1
NetC32_1: C32.1 U4.2(BOOT)
NetC32_2: C32.2 L2.1 Q1.1(S) Q1.2(S) Q1.3(S) Q2.5(D) Q2.6(D) Q2.7(D) Q2.8(D) U4.8(PHASE)
NetF1_1: F1.1 J4.1
NetF2_1: F2.1 J4.3
NetQ1_4: Q1.4(G) U4.1(UGATE)
NetQ2_4: Q2.4(G) U4.5(LGATE)

### Notes on the sheet
- (near J4) PV+
- (near J4) PV-
- (near J4) Batt+
- (near J4) Batt-
- All resistors are size 0603 (1608 Metric), 1/10 W, 1% or better, unless specifically noted
- All capacitors are ceramic, size 0603 (1608 Metric), X5R or better, unless specifically noted
- Title:
- Size:
- Date:
- A4
- Drawn By:
- Time:
- Engineer:
- Sheet
- of
- For educational
- purposes only!
- File:

### Library data of the parts
C29-C32 C34 = Cap SMD: Capacitor; Published: 8-Jun-2000; LatestRevisionDate: 17-Jul-2002; LatestRevisionNote: Re-released for DXP Platform.; PackageReference: RAD-0.3; Publisher: Altium Limited; PackageDescription: Radial Cap, Thru-Hole; 2 Leads; 0.3 in Pin Spacing
C33 = 860080374009: CAP ALUM 220UF 20% 16V THRU HOLE; Manufacturer: Wurth Electronics Inc.; Lifetime @ Temp.: 3000 Hrs @ 105°C; Polarization: Polar; Supplier 1: Digi-Key; RoHS: RoHS Compliant; Category: Capacitors; Stock 1: 716; Pricing 1: 1=0.33, 50=0.276, 100=0.2403, 250=0.21424 (CAD); Packaging: Cut Tape (CT); Part Status: Active; Tolerance: ±20%; ESR (Equivalent Series Resistance): -; Operating Temperature: -55°C ~ 105°C; Ratings: -; Applications: General Purpose; Lead Spacing: 0.138" (3.50mm); Size / Dimension: 0.315" Dia (8.00mm); Height - Seated (Max): 0.512" (13.00mm); Surface Mount Land Size: -; Mounting Type: Through Hole; Package / Case: Radial, Can; ComponentLink1URL: http://katalog.we-online.de/pbs/datasheet/860080374009.pdf; ComponentLink1Description: http://katalog.we-online.de/pbs/datasheet/860080374009.pdf; Supplier Part Number 1: 732-8997-1-ND; Manufacturer Part Number: 860080374009
F1 = 0ZCG0050AF2C: PTC RESET FUSE 30V 500MA 1812; Manufacturer: Bel Fuse Inc.; Type: Polymeric; Approvals: cURus, TUV; Supplier 1: Digi-Key; RoHS: RoHS Compliant; Category: Circuit Protection; Stock 1: 287653; Pricing 1: 1=0.19, 5=0.186, 10=0.18, 50=0.1598, 100=0.1488, 250=0.13232, 500=0.11026, 1000=0.10475 (CAD); Packaging: Cut Tape (CT); Part Status: Active; Voltage - Max: 30V; Operating Temperature: -40°C ~ 85°C; Ratings: -; Mounting Type: Surface Mount; Package / Case: 1812 (4532 Metric), Concave; Size / Dimension: 0.179" L x 0.128" W (4.55mm x 3.24mm); Height - Seated (Max): -; Thickness (Max): 0.030" (0.75mm); Lead Spacing: -; ComponentLink1URL: https://www.belfuse.com/resources/CircuitProtection/datasheets/0ZCG%20Nov2016.pdf; ComponentLink1Description: https://www.belfuse.com/resources/CircuitProtection/datasheets/0ZCG%20Nov2016.pdf; Supplier Part Number 1: 507-1762-1-ND; Manufacturer Part Number: 0ZCG0050AF2C
F2 = 0ZCG0260BF2B: PTC RESET FUSE 16V 2.6A 1812; Manufacturer: Bel Fuse Inc.; Type: Polymeric; Approvals: cURus, TUV; Supplier 1: Digi-Key; RoHS: RoHS Compliant; Category: Circuit Protection; Stock 1: 58933; Pricing 1: 1=0.39, 5=0.376, 10=0.358, 50=0.3196, 100=0.2977, 250=0.26464, 500=0.22052 (CAD); Packaging: Cut Tape (CT); Part Status: Active; Voltage - Max: 16V; Operating Temperature: -40°C ~ 85°C; Ratings: -; Mounting Type: Surface Mount; Package / Case: 1812 (4532 Metric), Concave; Size / Dimension: 0.179" L x 0.128" W (4.55mm x 3.24mm); Height - Seated (Max): -; Thickness (Max): 0.061" (1.55mm); Lead Spacing: -; ComponentLink1URL: https://www.belfuse.com/resources/CircuitProtection/datasheets/0ZCG%20Nov2016.pdf; ComponentLink1Description: https://www.belfuse.com/resources/CircuitProtection/datasheets/0ZCG%20Nov2016.pdf; Supplier Part Number 1: 507-1780-1-ND; Manufacturer Part Number: 0ZCG0260BF2B
J4 = 1984633: CONN TERM BLOCK T/H 4POS 3.5MM; Manufacturer: Phoenix Contact; Positions Per Level: 4; Pitch: 0.138" (3.50mm); Mating Orientation: Horizontal with Board; Wire Gauge: 16-26 AWG; Wire Termination: Screw; Torque - Screw: 0.22-0.25 Nm (1.9-2.2 Lb-In); Screw Thread: M2; Supplier 1: Digi-Key; RoHS: RoHS Compliant; Category: Connectors, Interconnects; Stock 1: 4509; Pricing 1: 1=1.24, 10=1.185, 50=1.133, 100=1.1021, 250=1.03, 500=0.94762, 1000=0.87551 (CAD); Packaging: Bulk; Part Status: Active; Mounting Type: Through Hole; Features: Interlocking (Side); Color: Green; Operating Temperature: -; Housing Material: Polyamide (PA), Nylon; Contact Material - Plating: -; Clamp Material - Plating: -; Screw Material - Plating: -; ComponentLink1URL: https://media.digikey.com/pdf/Data%20Sheets/Phoenix%20Contact%20PDFs/Combicon%20Compact%20Series.pdf; ComponentLink1Description: https://media.digikey.com/pdf/Data%20Sheets/Phoenix%20Contact%20PDFs/Combicon%20Compact%20Series.pdf; Supplier Part Number 1: 277-1860-ND; Manufacturer Part Number: 1984633
L2 = RLB1314-101KL: FIXED IND 100UH 1A 120 MOHM TH; Manufacturer: Bourns Inc.; Type: Wirewound; Material - Core: Ferrite; Tolerance: ±10%; Shielding: Unshielded; DC Resistance (DCR): 120 mOhm Max; Q @ Freq: 70 @ 796kHz; Supplier 1: Digi-Key; Manufacturer Part Number: RLB1314-101KL; RoHS: RoHS Compliant; Category: Inductors, Coils, Chokes; Stock 1: 2475; Pricing 1: 1=0.74, 10=0.654, 100=0.467, 500=0.39228, 1000=0.31756, 2500=0.29888 (CAD); Packaging: Bulk; Part Status: Active; Ratings: -; Operating Temperature: -40°C ~ 105°C; Mounting Type: Through Hole; Package / Case: Radial; Supplier Device Package: -; Size / Dimension: 0.461" Dia (11.70mm); Height - Seated (Max): 0.512" (13.00mm); ComponentLink1URL: http://www.bourns.com/docs/Product-Datasheets/rlb.pdf; ComponentLink1Description: http://www.bourns.com/docs/Product-Datasheets/rlb.pdf
Q1 Q2 = BUK9M53-60EX: MOSFET N-CH 60V 17A LFPAK; Manufacturer: Nexperia USA Inc.; FET Type: N-Channel; Current - Continuous Drain (Id) @ 25°C: 17A (Tc); Drive Voltage (Max Rds On,  Min Rds On): 5V; Vgs(th) (Max) @ Id: 2.1V @ 1mA; Vgs (Max): ±10V; Power Dissipation (Max): 36W (Tc); Rds On (Max) @ Id, Vgs: 46 mOhm @ 5A, 10V; Supplier 1: Digi-Key; RoHS: RoHS Compliant; Category: Discrete Semiconductor Products; Stock 1: 481; Pricing 1: 1=0.73, 10=0.61, 100=0.4575, 500=0.33548 (CAD); Packaging: Cut Tape (CT); Part Status: Active; Technology: MOSFET (Metal Oxide); FET Feature: -; Operating Temperature: -55°C ~ 175°C (TJ); Mounting Type: Surface Mount; Supplier Device Package: LFPAK33; Package / Case: SOT-1210, 8-LFPAK33 (5-Lead); ComponentLink1URL: https://assets.nexperia.com/documents/data-sheet/BUK9M53-60E.pdf; ComponentLink1Description: https://assets.nexperia.com/documents/data-sheet/BUK9M53-60E.pdf; Supplier Part Number 1: 1727-2583-1-ND; Manufacturer Part Number: BUK9M53-60EX
R24-R28 = Res SMD: Resistor; Published: 8-Jun-2000; LatestRevisionDate: 17-Jul-2002; LatestRevisionNote: Re-released for DXP Platform.; PackageReference: AXIAL-0.3; Publisher: Altium Limited; PackageDescription: Axial Device, Thru-Hole; 2 Leads; 0.3 in Pin Spacing
U4 = ISL6208CBZ-T: IC MOSFET DRVR SYNC BUCK 8-SOIC; Manufacturer: Intersil; Driven Configuration: Half-Bridge; Channel Type: Synchronous; Gate Type: N-Channel MOSFET; Voltage - Supply: 4.5 V ~ 5.5 V; Logic Voltage - VIL, VIH: 0.5V, 2V; Current - Peak Output (Source, Sink): 2A, 2A; Input Type: Non-Inverting; Rise / Fall Time (Typ): 8ns, 8ns; Supplier 1: Digi-Key; Manufacturer Part Number: ISL6208CBZ-T; RoHS: RoHS Compliant; Category: Integrated Circuits (ICs); Stock 1: 1957; Pricing 1: 1=2.62, 10=2.355, 100=1.893, 500=1.55528, 1000=1.28866 (CAD); Packaging: Cut Tape (CT); Part Status: Active; Operating Temperature: -10°C ~ 125°C (TJ); Mounting Type: Surface Mount; Package / Case: 8-SOIC (0.154", 3.90mm Width); Supplier Device Package: 8-SOIC; Base Part Number: ISL6208; ComponentLink1URL: http://www.intersil.com/content/dam/intersil/documents/isl6/isl6208-b.pdf; ComponentLink1Description: http://www.intersil.com/content/dam/intersil/documents/isl6/isl6208-b.pdf
Z2 = SMCJ26A-13-F: TVS DIODE 26VWM 42.1VC SMC; Manufacturer: Diodes Incorporated; Voltage - Reverse Standoff (Typ): 26V; Voltage - Breakdown (Min): 28.9V; Voltage - Clamping (Max) @ Ipp: 42.1V; Current - Peak Pulse (10/1000µs): 35.6A; Power - Peak Pulse: 1500W (1.5kW); Power Line Protection: No; Supplier 1: Digi-Key; RoHS: RoHS Compliant; Category: Circuit Protection; Stock 1: 3205; Pricing 1: 1=0.88, 10=0.77, 100=0.5905, 500=0.4668, 1000=0.37344 (CAD); Packaging: Cut Tape (CT); Part Status: Active; Type: Zener; Applications: General Purpose; Capacitance @ Frequency: -; Operating Temperature: -55°C ~ 150°C (TJ); Mounting Type: Surface Mount; Package / Case: DO-214AB, SMC; Supplier Device Package: SMC; Base Part Number: SMCJ26; ComponentLink1URL: https://www.diodes.com/assets/Datasheets/ds19003.pdf; ComponentLink1Description: https://www.diodes.com/assets/Datasheets/ds19003.pdf; Supplier Part Number 1: SMCJ26A-FDICT-ND; Manufacturer Part Number: SMCJ26A-13-F
Z3 = SMCJ160A: TVS DIODE 160VWM 259VC SMC; Manufacturer: ON Semiconductor; Voltage - Reverse Standoff (Typ): 160V; Voltage - Breakdown (Min): 178V; Voltage - Clamping (Max) @ Ipp: 259V; Current - Peak Pulse (10/1000µs): 5.8A; Power - Peak Pulse: 1500W (1.5kW); Power Line Protection: No; Supplier 1: Digi-Key; Manufacturer Part Number: SMCJ160A; RoHS: RoHS Compliant; Category: Circuit Protection; Stock 1: 16752; Pricing 1: 1=0.84, 10=0.732, 100=0.561, 500=0.44352, 1000=0.35481 (CAD); Packaging: Cut Tape (CT); Part Status: Active; Type: Zener; Applications: General Purpose; Capacitance @ Frequency: -; Operating Temperature: -; Mounting Type: Surface Mount; Package / Case: DO-214AB, SMC; Supplier Device Package: SMC (DO-214AB); Base Part Number: SMCJ160; ComponentLink1URL: https://www.fairchildsemi.com/datasheets/SM/SMCJ100A.pdf; ComponentLink1Description: https://www.fairchildsemi.com/datasheets/SM/SMCJ100A.pdf; Supplier Part Number 1: SMCJ160AFSCT-ND

## Nets that join several sheets
4.096V: MPPT_V1.0.1_MCU_and_Display (U1.29), MPPT_V1.0.1_Analog (7 pins)
5V: MPPT_V1.0.1_MCU_and_Display (10 pins), MPPT_V1.0.1_Analog (R6.2), MPPT_V1.0.1_5V_Supply (14 pins), MPPT_V1.0.1_Charger_Converter (R24.2 U4.6)
GND: MPPT_V1.0.1_MCU_and_Display (21 pins), MPPT_V1.0.1_Analog (12 pins), MPPT_V1.0.1_5V_Supply (21 pins), MPPT_V1.0.1_Charger_Converter (15 pins)
V_Batt: MPPT_V1.0.1_Analog (R7.2), MPPT_V1.0.1_5V_Supply (C17.2 C18.2 R3.2 U3.2), MPPT_V1.0.1_Charger_Converter (5 pins)
V_PV: MPPT_V1.0.1_Analog (R29.2), MPPT_V1.0.1_Charger_Converter (9 pins)
Analog_Signal_Batt_I: MPPT_V1.0.1_MCU_and_Display (U1.30), MPPT_V1.0.1_Analog (C12.1 R15.1 U2.7)
Analog_Signal_Batt_V: MPPT_V1.0.1_MCU_and_Display (U1.31), MPPT_V1.0.1_Analog (U2.1 U2.2)
Analog_Signal_PV_I: MPPT_V1.0.1_MCU_and_Display (U1.32), MPPT_V1.0.1_Analog (C13.1 R16.1 U2.8)
Analog_Signal_PV_V: MPPT_V1.0.1_MCU_and_Display (U1.33), MPPT_V1.0.1_Analog (U2.13 U2.14)
Batt_Shunt: MPPT_V1.0.1_Analog (R12.1), MPPT_V1.0.1_Charger_Converter (J4.4 R28.2)
Charger_FCCM: MPPT_V1.0.1_MCU_and_Display (U1.43), MPPT_V1.0.1_Charger_Converter (R26.2 U4.7)
Charger_PWM: MPPT_V1.0.1_MCU_and_Display (U1.44), MPPT_V1.0.1_Charger_Converter (R24.1 R25.2 U4.3)
PV_Shunt: MPPT_V1.0.1_Analog (R13.2), MPPT_V1.0.1_Charger_Converter (J4.2 R27.1)